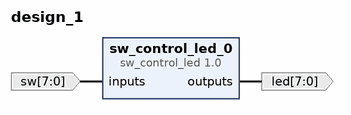
[diagram p0: block diagram of the top level]
# Vivado block design design_1, xc7z020clg484-1, Vivado 2019.2
create_bd_design design_1

create_bd_port -dir I -from 7 -to 0 -type data sw
create_bd_port -dir O -from 7 -to 0 -type data led

create_bd_cell -type ip -vlnv xilinx.com:hls:sw_control_led:1.0 sw_control_led_0

# ---- connections ----

connect_bd_net -net inputs_0_1 [get_bd_ports sw] [get_bd_pins sw_control_led_0/inputs]
connect_bd_net [get_bd_pins sw_control_led_0/outputs] [get_bd_ports led]

validate_bd_design
save_bd_design
